# EAGLE design PMOD-RS485TX (EAGLE 6.4)
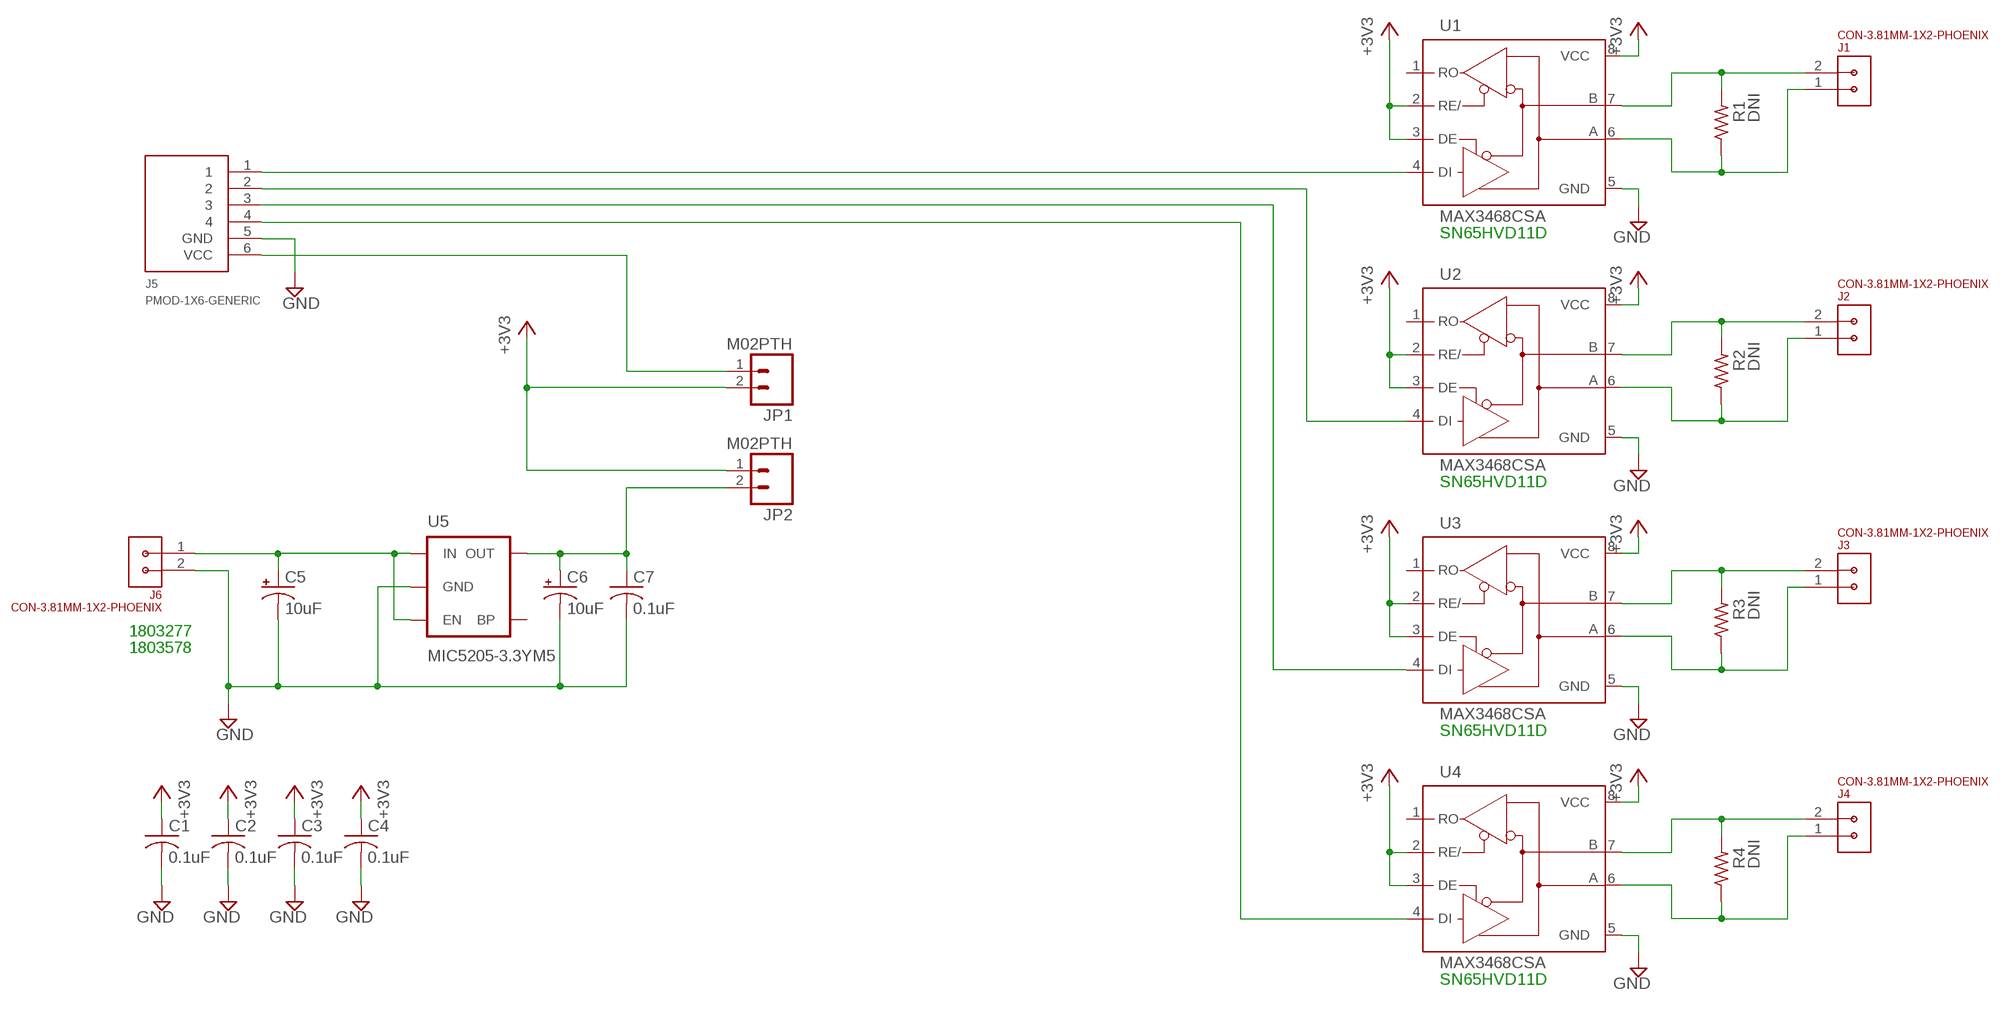
[diagram p0: schematic, sheet 1]

## Parts
C1  0.1uF  C-USC1206  [C1206]
C2  0.1uF  C-USC1206  [C1206]
C3  0.1uF  C-USC1206  [C1206]
C4  0.1uF  C-USC1206  [C1206]
C5  10uF  CPOL-USD  [PANASONIC_D]
C6  10uF  CPOL-USD  [PANASONIC_D]
C7  0.1uF  C-USC1206  [C1206]
J1  CON-3.81MM-1X2-PHOENIX  [CON-PHOENIX-3.81-1X2-RA]
J2  CON-3.81MM-1X2-PHOENIX  [CON-PHOENIX-3.81-1X2-RA]
J3  CON-3.81MM-1X2-PHOENIX  [CON-PHOENIX-3.81-1X2-RA]
J4  CON-3.81MM-1X2-PHOENIX  [CON-PHOENIX-3.81-1X2-RA]
J5  PMOD-1X6-GENERIC  [CON-PMOD-1X6]
J6  CON-3.81MM-1X2-PHOENIX  [CON-PHOENIX-3.81-1X2-RA]
JP1  M02PTH  [1X02]
JP2  M02PTH  [1X02]
R1  DNI  R-US_M1206  [M1206]
R2  DNI  R-US_M1206  [M1206]
R3  DNI  R-US_M1206  [M1206]
R4  DNI  R-US_M1206  [M1206]
U1  MAX3468CSA  [SO08]
U2  MAX3468CSA  [SO08]
U3  MAX3468CSA  [SO08]
U4  MAX3468CSA  [SO08]
U5  MIC5205-3.3YM5  V_REG_LDOSMD  [SOT23-5]

## Nets
+3V3: C1.1 C2.1 C3.1 C4.1 JP1.2 JP2.1 U1.2(RE/) U1.3(DE) U1.8(VCC) U2.2(RE/) U2.3(DE) U2.8(VCC) U3.2(RE/) U3.3(DE) U3.8(VCC) U4.2(RE/) U4.3(DE) U4.8(VCC)
+5V: C5.+ J6.1 U5.1(IN) U5.3(EN)
GND: C1.2 C2.2 C3.2 C4.2 C5.- C6.- C7.2 J5.5(GND) J6.2 U1.5(GND) U2.5(GND) U3.5(GND) U4.5(GND) U5.2(GND)
N$1: C6.+ C7.1 JP2.2 U5.5(OUT)
N$2: J2.2 R2.2 U2.7(B)
N$3: J2.1 R2.1 U2.6(A)
N$4: J3.2 R3.2 U3.7(B)
N$5: J1.2 R1.2 U1.7(B)
N$6: J3.1 R3.1 U3.6(A)
N$7: J1.1 R1.1 U1.6(A)
N$8: J4.2 R4.2 U4.7(B)
N$9: J4.1 R4.1 U4.6(A)
N$10: J5.1 U1.4(DI)
N$11: J5.2 U2.4(DI)
N$12: J5.3 U3.4(DI)
N$13: J5.4 U4.4(DI)
N$14: J5.6(VCC) JP1.1
Unconnected: U1.1(RO) U2.1(RO) U3.1(RO) U4.1(RO) U5.4(BP)

## Notes on the sheet
- SN65HVD11D
- SN65HVD11D
- 1803277
- 1803578
- SN65HVD11D
- SN65HVD11D

## Library data of the parts
C1-C4 C7 = rcl:C-US: CAPACITOR, American symbol
C5 C6 = rcl:CPOL-US: POLARIZED CAPACITOR, American symbol
J1-J4 J6 = 0GlenConnectors:CON-3.81MM-1X2-PHOENIX
J5 = 0GlenConnectors:PMOD-1X6-GENERIC
JP1 JP2 = SparkFun-Connectors:M02: Standard 2-pin 0.1" header. Use with - straight break away headers ( PRT-00116) - right angle break away headers (PRT-00553) - swiss pins (PRT-00743) - machine pins (PRT-00117) - female headers (PRT-00115) Molex polarized connector foot print use with: PRT-08233 with associated crimp pins and housings. 2.54_SCREWTERM for use with PRT-10571. 3.5mm Screw Terminal footprints for PRT-08084 5mm Screw Terminal footprints for use with PRT-08433
R1-R4 = rcl:R-US_: RESISTOR, American symbol
U1-U4 = maxim:MAX34*: +5V, Fail-Safe, 40Mbps, Profibus RS-485/RS-422 Transceivers Source: MAX3465-MAX3469.pdf; MPN: MAX3468CSA+; OC_FARNELL: unknown; OC_NEWARK: 76K6721
U5 = SparkFun-PowerIC:V_REG_LDO: Voltage Regulator LDO Standard 150mA LDO voltage regulator in SOT-23 layout. Micrel part MIC5205. BP (by-pass) pin is used to lower output noise with 470pF cap.

## Board
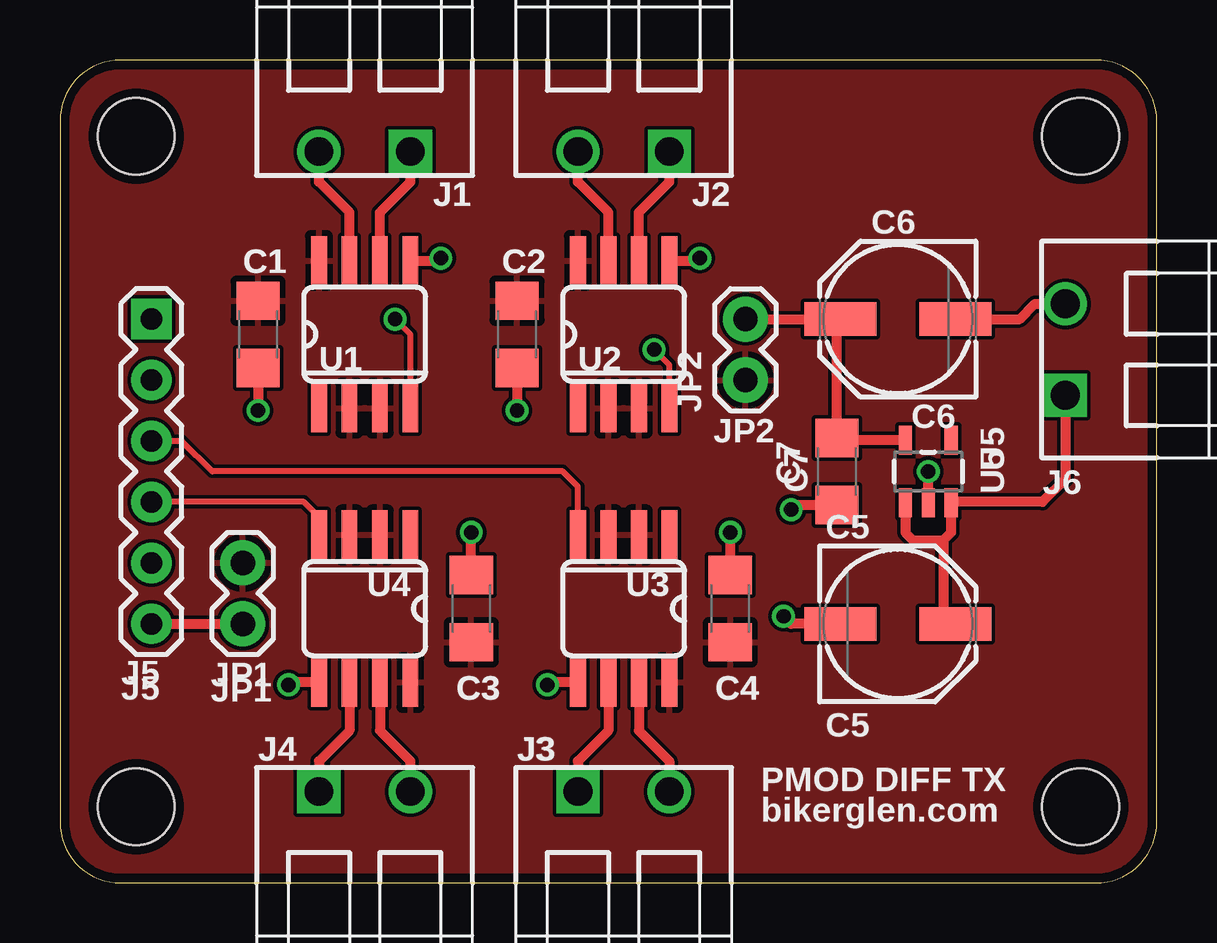
[diagram p1: board, top side]
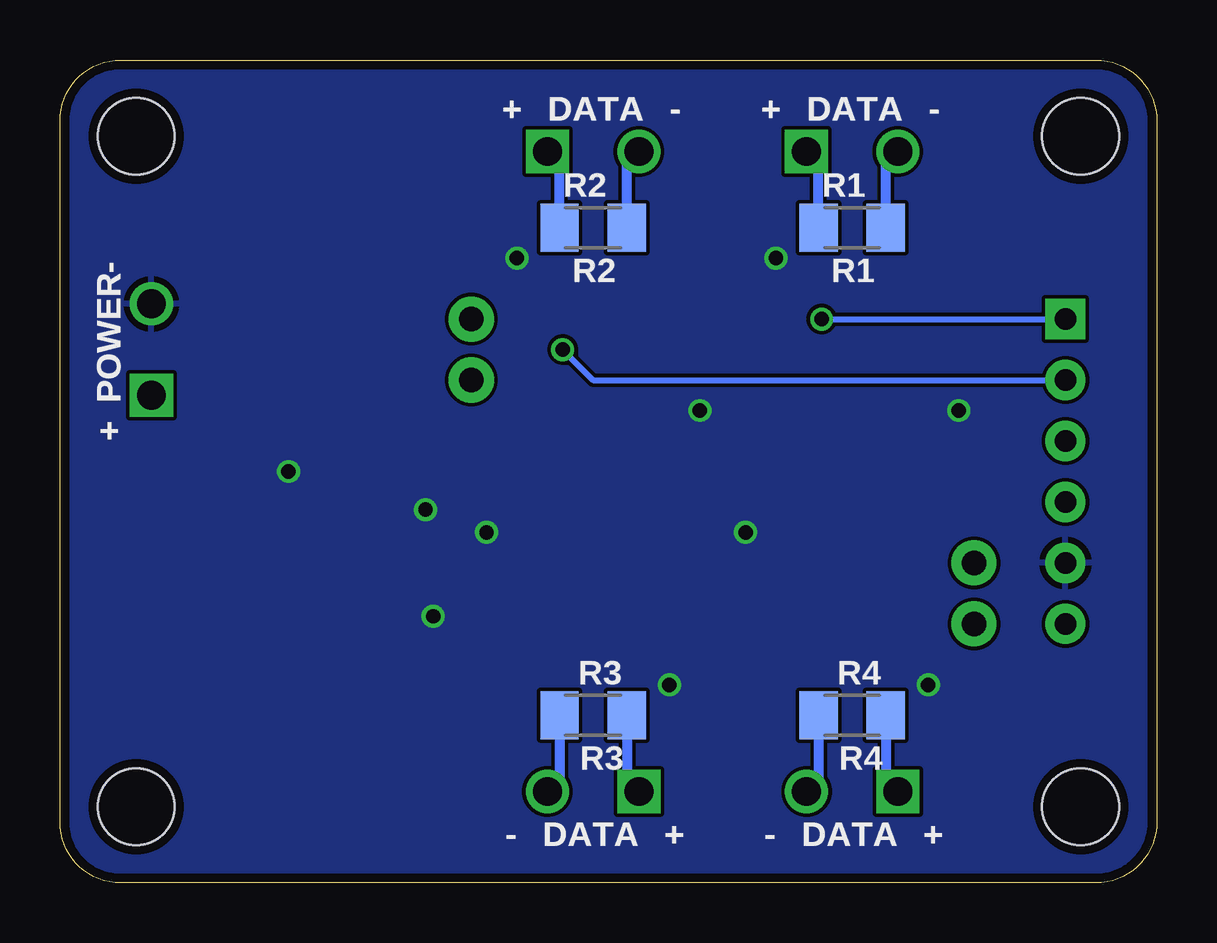
[diagram p2: board, bottom side, seen from below]

Size 45.72 x 34.29 mm. Coordinates in mm from the lower left corner, seen from the top.
Outline: 0,31.75 0,2.54 arc90 2.54,0 43.18,0 arc90 45.72,2.54 45.72,31.75 arc90 43.18,34.29 2.54,34.29 arc90 0,31.75
Copper layers (1*16): Top 0.0356mm / dielectric 1.5011mm / Bottom 0.0356mm
Design rules "LaenPCBOrder": minimum track width 6mil, minimum drill 13mil, track to track 6mil, track to pad 6mil, pad to pad 6mil, via to via 6mil, smd to smd 6mil, copper to edge 15mil, drill to drill 6mil, minimum pad ring 7mil, minimum via ring 7mil, stop-mask expansion 4mil, vias tented up to drill 0mil, thermal gap 10mil
Holes 3.2 mm at 3.17,3.17 3.17,31.11 42.55,31.11 42.55,3.17

### Footprints (pad centres in the part's own frame; a part is rotated, then mirrored left to right if it is on the bottom)
C1206 = smd 1.6 x 1.8: 1 -1.4,0; 2 1.4,0
PANASONIC_D = smd 3 x 1.4: + 2.4,0; - -2.4,0
CON-PHOENIX-3.81-1X2-RA = drill 1.2 square: 1 0,0 | drill 1.2: 2 3.81,0
CON-PMOD-1X6 = drill 0.9 pad 1.676 square: 1 0,6.35 | drill 0.9 pad 1.676: 2 0,3.81; 3 0,1.27; 4 0,-1.27; 5 0,-3.81; 6 0,-6.35
1X02 = drill 1.016 pad 1.88: 1 0,0; 2 2.54,0
M1206 = smd 1.6 x 2: 1 -1.4,0; 2 1.4,0
SO08 = smd 0.66 x 2.032: 1 -1.905,-3.073; 2 -0.635,-3.073; 3 0.635,-3.073; 4 1.905,-3.073; 5 1.905,3.073; 6 0.635,3.073; 7 -0.635,3.073; 8 -1.905,3.073
SOT23-5 = smd 0.55 x 1.2: 1 -0.95,-1.3; 2 0,-1.3; 3 0.95,-1.3; 4 0.95,1.3; 5 -0.95,1.3

### Placement (x,y rotation side)
C1  8.26,22.86 270 top
C2  19.05,22.86 270 top
C3  17.14,11.43 90 top
C4  27.94,11.43 90 top
C5  34.92,10.79 0 top
C6  34.92,23.5 180 top
C7  32.38,17.14 270 top
J1  14.61,30.48 180 top
J2  25.4,30.48 180 top
J3  21.59,3.81 0 top
J4  10.79,3.81 0 top
J5  3.81,17.14 0 top
J6  41.91,20.32 90 top
JP1  7.62,10.79 90 top
JP2  28.57,20.95 90 top
R1  12.7,27.3 0 bottom
R2  23.5,27.3 0 bottom
R3  23.5,6.99 180 bottom
R4  12.7,6.99 180 bottom
U1  12.7,22.86 0 top
U2  23.5,22.86 0 top
U3  23.5,11.43 180 top
U4  12.7,11.43 180 top
U5  36.2,17.14 0 top

### Tracks (layer width: path | path; a pad name or v marks a point on that pad's centre or on a via)
+3V3
  pour Top: 43.18,0 2.54,0 arc-90 0,2.54 0,31.75 arc-90 2.54,34.29 43.18,34.29 arc-90 45.72,31.75 45.72,2.54 arc-90
+5V
  Top 0.406: J6.1 41.91,16.83 40.96,15.88 37.17,15.88 U5.3 37.15,14.61 36.83,14.29 | U5.1 35.24,14.6 35.56,14.29 36.83,14.29 | 36.83,14.29 36.83,11.29 C5.+
GND  (via drill 0.6)
  Top 0.406: U1.5 15.77,25.93 v15.88,26.04 | U2.5 26.57,25.93 v26.67,26.04 | C3.2 v17.14,14.61 | C4.2 v27.94,14.61 | C2.2 v19.05,19.68 | C1.2 v8.26,19.68 | U3.5 20.42,8.36 v20.32,8.26 | U4.5 9.63,8.36 v9.53,8.26 | C6.- 40.01,23.5 40.64,24.13 J6.2 | U5.2 v36.2,17.14 | C7.2 30.67,15.74 v30.48,15.56 | C5.- 30.48,10.79 v30.16,11.11
  pour Bottom: 0,31.75 0,2.54 arc90 2.54,0 43.18,0 arc90 45.72,2.54 45.72,31.75 arc90 43.18,34.29 2.54,34.29 arc90
N$1
  Top 0.406: JP2.2 31.75,23.5 | 31.75,23.5 C6.+ | C7.1 32.38,19.05 | 32.38,19.05 32.38,22.86 31.75,23.5 | U5.5 32.99,18.45 32.38,19.05
N$2
  Top 0.406: U2.7 22.86,27.94 21.59,29.21 J2.2
  Bottom 0.406: R2.2 22.09,29.98 J2.2
N$3
  Top 0.406: U2.6 24.13,27.94 25.4,29.21 J2.1
  Bottom 0.406: R2.1 24.89,29.98 J2.1
N$4
  Top 0.406: U3.7 24.13,6.35 25.4,5.08 J3.2
  Bottom 0.406: R3.2 24.89,4.32 J3.2
N$5
  Top 0.406: U1.7 12.06,27.94 10.79,29.21 J1.2
  Bottom 0.406: R1.2 11.3,29.98 J1.2
N$6
  Top 0.406: U3.6 22.86,6.35 21.59,5.08 J3.1
  Bottom 0.406: R3.1 22.09,4.32 J3.1
N$7
  Top 0.406: U1.6 13.34,27.94 14.61,29.21 J1.1
  Bottom 0.406: R1.1 14.1,29.98 J1.1
N$8
  Top 0.406: J4.2 14.61,5.08 13.34,6.35 U4.7
  Bottom 0.406: R4.2 14.1,4.32 J4.2
N$9
  Top 0.406: U4.6 12.06,6.35 10.79,5.08 J4.1
  Bottom 0.406: R4.1 11.3,4.32 J4.1
N$10  (via drill 0.6)
  Top 0.254: U1.4 14.61,22.86 v13.97,23.5
  Bottom 0.254: v13.97,23.5 J5.1
N$11  (via drill 0.6)
  Top 0.254: U2.4 25.4,21.59 v24.77,22.23
  Bottom 0.254: v24.77,22.23 23.5,20.95 J5.2
N$12
  Top 0.254: U3.4 21.59,16.51 20.95,17.14 6.35,17.14 5.08,18.41 J5.3
N$13
  Top 0.254: U4.4 10.79,15.24 10.16,15.88 J5.4
N$14
  Top 0.406: J5.6 JP1.1

### Text on the board
bNames: - | DATA | + | - | DATA | + | - | POWER | + | + | DATA | - | + | DATA | -
_tsilk: J1 | J2 | C6 | C1 | C2 | U1 | U2 | U5 | JP2 | C7 | J6 | U4 | U3 | J5 | JP1 | C3 | C4 | C5 | J4 | J3 | PMOD DIFF TX | bikerglen.com
_bsilk: - | DATA | + | - | DATA | + | R1 | R2 | - | POWER | + | R4 | R3 | + | DATA | - | + | DATA | -